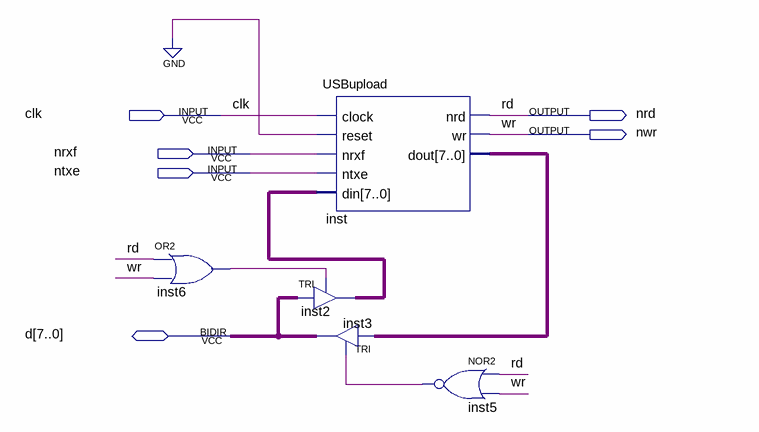
[diagram p0: schematic sheet]
// Quartus schematic USBupload_top.bdf as structural Verilog: 5 symbols, 6 pins
module USBupload_top (
  input  clk,
  input  nrxf,
  input  ntxe,
  inout  [7:0] d,
  output nrd,
  output nwr
);

  wire inst5_out, inst6_out;
  wire [7:0] inst2_out, inst_dout;

  or inst6 (inst6_out, nrd, nwr);
  TRI inst2[7:0] (.IN(d), .OE(inst6_out), .OUT(inst2_out));
  USBupload inst (
    .clock(clk), .reset(1'b0), .nrxf(nrxf), .ntxe(ntxe), .din(inst2_out), .nrd(nrd), .wr(nwr),
    .dout(inst_dout));
  TRI inst3[7:0] (.IN(inst_dout), .OE(inst5_out), .OUT(d));
  nor inst5 (inst5_out, nrd, nwr);

  // Other names for the same wires on the sheet: rd = nrd; wr = nwr
endmodule
